# Altium schematic sheet Sensors_IO.SchDoc: Internal Sensors IO
size A4; DrawnBy: Samyar Sadat Akhavi; Revision: 1.0; SheetNumber: 4; SheetTotal: 12
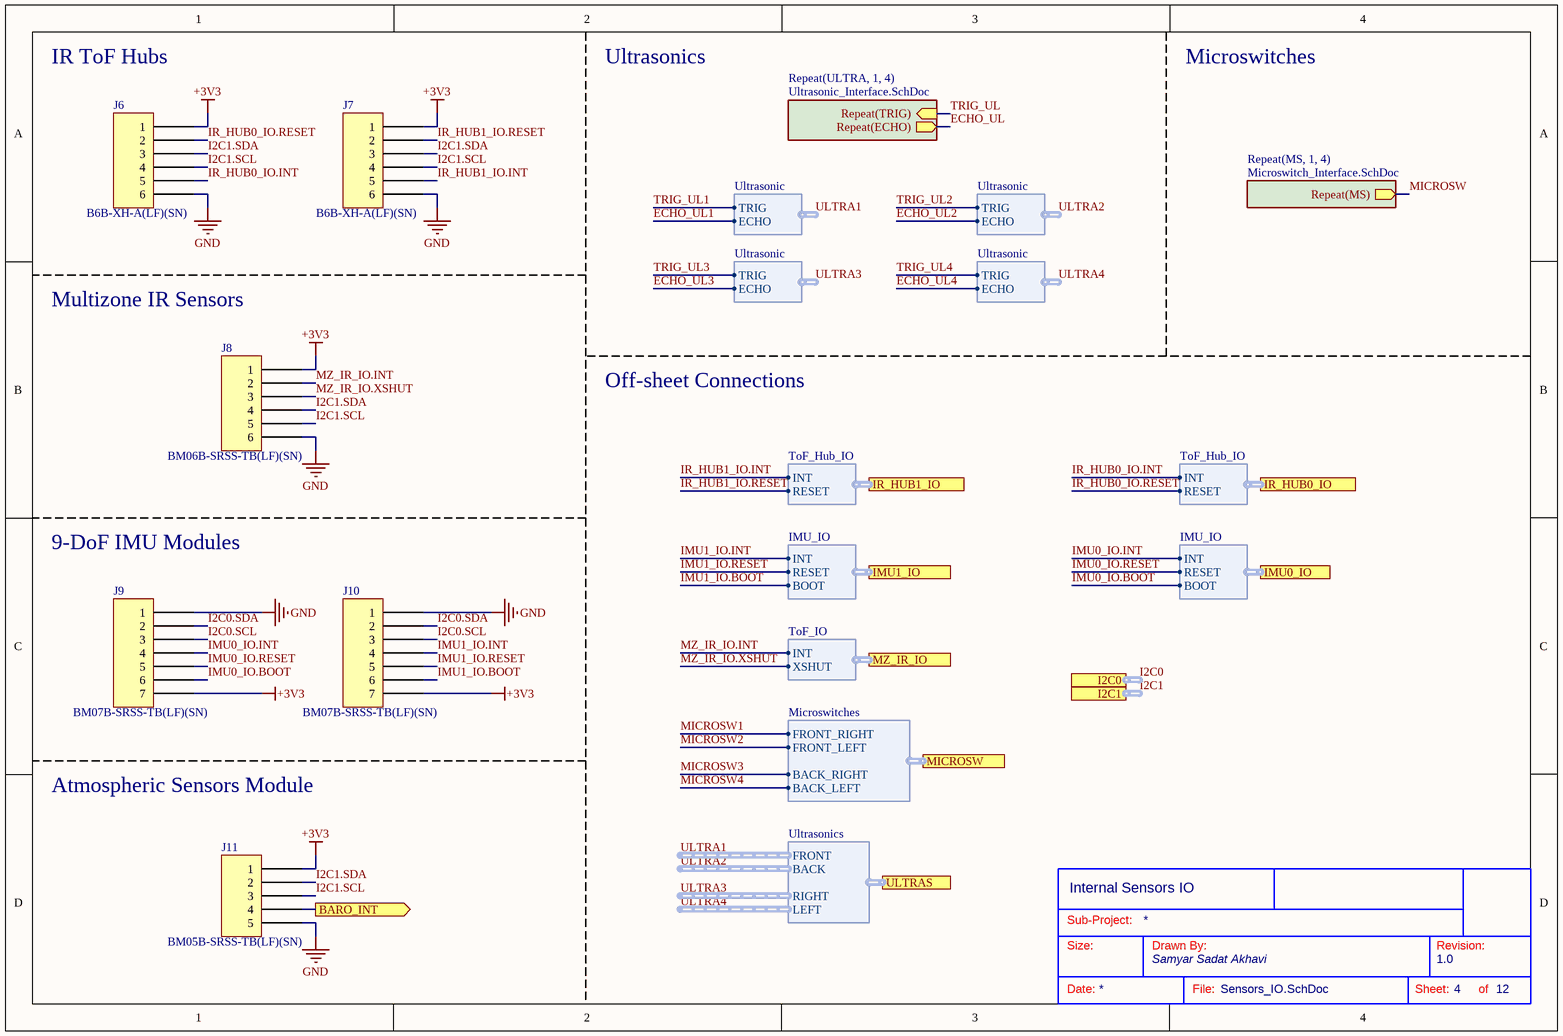
[diagram p0: Sensors_IO.SchDoc]

## Parts
?  (no value)  (graphical)
J6  B6B-XH-A(LF)(SN)  [JST XH B6B-XH-A]
J7  B6B-XH-A(LF)(SN)  [JST XH B6B-XH-A]
J8  BM06B-SRSS-TB(LF)(SN)  [JST BM06B-SRSS-TB]
J9  BM07B-SRSS-TB(LF)(SN)  [JST BM07B-SRSS-TB]
J10  BM07B-SRSS-TB(LF)(SN)  [JST BM07B-SRSS-TB]
J11  BM05B-SRSS-TB(LF)(SN)  [JST BM05B-SRSS-TB]

## Sub-sheets
Repeat(MS, 1, 4) = Microswitch_Interface.SchDoc: Repeat(MS) (out)
Repeat(ULTRA, 1, 4) = Ultrasonic_Interface.SchDoc: Repeat(TRIG) (in), Repeat(ECHO) (out)

## Ports
BARO_INT (out, see Sensors_IO_Board[2B], Microcontroller[3B]), I2C0 (harness I2C, see Sensors_IO_Board[2B], Aux_Power_Bus[4C], Microcontroller[5C], Thermal[4C]), I2C1 (harness I2C, see Sensors_IO_Board[2B], Microcontroller[6C], Thermal[4C]), IMU0_IO (harness IMU_IO, see Sensors_IO_Board[2B], Microcontroller[3B]), IMU1_IO (harness IMU_IO, see Sensors_IO_Board[2B], Microcontroller[3B]), IR_HUB0_IO (harness TOF_HUB_IO, see Sensors_IO_Board[2B], Microcontroller[3B]), IR_HUB1_IO (harness TOF_HUB_IO, see Sensors_IO_Board[2B], Microcontroller[3B]), MICROSW (harness Microswitches, see Sensors_IO_Board[2B], Microcontroller[3B]), MZ_IR_IO (harness TOF_IO, see Sensors_IO_Board[2B], Microcontroller[3B]), ULTRAS (harness Ultrasonics, see Sensors_IO_Board[2B], Microcontroller[3B])

## Harnesses
Microswitches: BACK_LEFT, FRONT_RIGHT, FRONT_LEFT, BACK_RIGHT
IMU_IO: INT, RESET, BOOT
ToF_IO: INT, XSHUT
ToF_Hub_IO: INT, RESET
Ultrasonics: LEFT, FRONT, BACK, RIGHT
Ultrasonic: TRIG, ECHO

## Nets
+3V3: J6.1 J7.1 J8.1 J9.7 J10.7 J11.1
GND: J6.6 J7.6 J8.6 J9.1 J10.1 J11.5
BARO_INT: J11.4 ; port BARO_INT
ECHO_UL: sheet Repeat(ULTRA, 1, 4)/Repeat(ECHO)
ECHO_UL1: harness Ultrasonic.ECHO
ECHO_UL2: harness Ultrasonic.ECHO
ECHO_UL3: harness Ultrasonic.ECHO
ECHO_UL4: harness Ultrasonic.ECHO
I2C0.SCL: J9.3 J10.3
I2C0.SDA: J9.2 J10.2
I2C1.SCL: J6.4 J7.4 J8.5 J11.3
I2C1.SDA: J6.3 J7.3 J8.4 J11.2
IMU0_IO.BOOT: J9.6 ; port IMU0_IO.BOOT
IMU0_IO.INT: J9.4 ; port IMU0_IO.INT
IMU0_IO.RESET: J9.5 ; port IMU0_IO.RESET
IMU1_IO.BOOT: J10.6 ; port IMU1_IO.BOOT
IMU1_IO.INT: J10.4 ; port IMU1_IO.INT
IMU1_IO.RESET: J10.5 ; port IMU1_IO.RESET
IR_HUB0_IO.INT: J6.5 ; port IR_HUB0_IO.INT
IR_HUB0_IO.RESET: J6.2 ; port IR_HUB0_IO.RESET
IR_HUB1_IO.INT: J7.5 ; port IR_HUB1_IO.INT
IR_HUB1_IO.RESET: J7.2 ; port IR_HUB1_IO.RESET
MICROSW: sheet Repeat(MS, 1, 4)/Repeat(MS)
MICROSW1: port MICROSW.FRONT_RIGHT
MICROSW2: port MICROSW.FRONT_LEFT
MICROSW3: port MICROSW.BACK_RIGHT
MICROSW4: port MICROSW.BACK_LEFT
MZ_IR_IO.INT: J8.2 ; port MZ_IR_IO.INT
MZ_IR_IO.XSHUT: J8.3 ; port MZ_IR_IO.XSHUT
TRIG_UL: sheet Repeat(ULTRA, 1, 4)/Repeat(TRIG)
TRIG_UL1: harness Ultrasonic.TRIG
TRIG_UL2: harness Ultrasonic.TRIG
TRIG_UL3: harness Ultrasonic.TRIG
TRIG_UL4: harness Ultrasonic.TRIG

## Buses and harness runs
harness I2C0 = port I2C0
harness I2C1 = port I2C1

## Notes on the sheet
- IR ToF Hubs
- Ultrasonics
- Microswitches
- Multizone IR Sensors
- Off-sheet Connections
- 9-DoF IMU Modules
- Atmospheric Sensors Module
- Sub-Project:
- Size:
- Drawn By:
- Revision:
- Date:
- File:
- Sheet:
- of

## Library data of the parts
? = Standard Title Block
J6 J7 = B6B-XH-A(LF)(SN): CONN HEADER VERT 6POS 2.5MM; Manufacturer: JST Sales America Inc.; Contact Length - Post: 0.134" (3.40mm); Current Rating (Amps): 3A; Material Flammability Rating: UL94 V-0; Number of Positions: 6; Number of Positions Loaded: All; Pitch - Mating: 0.098" (2.50mm); Shrouding: Shrouded - 4 Wall; Style: Board to Cable/Wire; Voltage Rating: 250V; Part Number: B6B-XH-A(LF)(SN); ComponentLink1Description: Datasheet; ComponentLink1URL: http://www.jst-mfg.com/product/pdf/eng/eXH.pdf; ComponentLink2Description: DigiKey Link; ComponentLink2URL: http://digikey.com/product-detail/en/jst-sales-america-inc/B6B-XH-A-LF-SN/455-2271-ND/1000381; Connector Type: Header; Contact Finish - Mating: Tin; Contact Finish - Post: Tin; Contact Material: Brass; Contact Shape: Square; Contact Type: Male Pin; Fastening Type: Detent Lock; Insulation Color: Natural; Insulation Height: 0.276" (7.00mm); Insulation Material: Polyamide (PA66), Nylon 6/6; LastUpdated: 1/12/2020 11:46:58 PM; Lifecycle Status: Active; Minimum Order: 1; Mounting Type: Through Hole; Number of Rows: 1; Operating Temperature: -25°C ~ 85°C; Packaging: Bulk; PartId: 71; Part Status: Active; Price: 0.27; Series: XH; Supplier 1: DigiKey; Supplier Part Number 1: 455-2271-ND; Termination: Press-Fit, Solder
J8 = BM06B-SRSS-TB(LF)(SN): CONN HEADER SMD 6POS 1MM; Manufacturer: JST Sales America Inc.; Current Rating (Amps): 0.7A; Material Flammability Rating: UL94 V-0; Number of Positions: 6; Number of Positions Loaded: All; Pitch - Mating: 0.039" (1.00mm); Shrouding: Shrouded - 4 Wall; Style: Board to Cable/Wire; Voltage Rating: 50V; Part Number: BM06B-SRSS-TB(LF)(SN); ComponentLink1Description: Datasheet; ComponentLink1URL: http://www.jst-mfg.com/product/pdf/eng/eSH.pdf; ComponentLink2Description: DigiKey Link; ComponentLink2URL: http://digikey.com/product-detail/en/jst-sales-america-inc/BM06B-SRSS-TB-LF-SN/455-1792-1-ND/926863; Connector Type: Header; Contact Finish - Mating: Tin; Contact Finish - Post: Tin; Contact Material: Copper Alloy; Contact Shape: Square; Contact Type: Male Pin; Fastening Type: Push-Pull; Features: Solder Retention; Insulation Color: Natural; Insulation Height: 0.167" (4.25mm); Insulation Material: Polyamide (PA), Nylon; LastUpdated: 1/12/2020 10:14:30 PM; Lifecycle Status: Active; Minimum Order: 1; Mounting Type: Surface Mount; Number of Rows: 1; Operating Temperature: -25°C ~ 85°C; Packaging: TapeAndReel; PartId: 20; Part Status: Active; Price: 0.38; Series: SR; Supplier 1: DigiKey; Supplier Part Number 1: 455-1792-1-ND; Termination: Solder
J9 J10 = BM07B-SRSS-TB(LF)(SN): CONN HEADER SMD 7POS 1MM; Manufacturer: JST Sales America Inc.; Current Rating (Amps): 0.7A; Material Flammability Rating: UL94 V-0; Number of Positions: 7; Number of Positions Loaded: All; Pitch - Mating: 0.039" (1.00mm); Shrouding: Shrouded - 4 Wall; Style: Board to Cable/Wire; Voltage Rating: 50V; Part Number: BM07B-SRSS-TB(LF)(SN); ComponentLink1Description: Datasheet; ComponentLink1URL: http://www.jst-mfg.com/product/pdf/eng/eSH.pdf; ComponentLink2Description: DigiKey Link; ComponentLink2URL: http://digikey.com/product-detail/en/jst-sales-america-inc/BM07B-SRSS-TB-LF-SN/455-1793-1-ND/926864; Connector Type: Header; Contact Finish - Mating: Tin; Contact Finish - Post: Tin; Contact Material: Copper Alloy; Contact Shape: Square; Contact Type: Male Pin; Fastening Type: Push-Pull; Features: Solder Retention; Insulation Color: Natural; Insulation Height: 0.167" (4.25mm); Insulation Material: Polyamide (PA), Nylon; LastUpdated: 1/12/2020 10:15:04 PM; Lifecycle Status: Active; Minimum Order: 1; Mounting Type: Surface Mount; Number of Rows: 1; Operating Temperature: -25°C ~ 85°C; Packaging: TapeAndReel; PartId: 22; Part Status: Active; Price: 0.42; Series: SR; Supplier 1: DigiKey; Supplier Part Number 1: 455-1793-1-ND; Termination: Solder
J11 = BM05B-SRSS-TB(LF)(SN): CONN HEADER SMD 5POS 1MM; Manufacturer: JST Sales America Inc.; Current Rating (Amps): 0.7A; Material Flammability Rating: UL94 V-0; Number of Positions: 5; Number of Positions Loaded: All; Pitch - Mating: 0.039" (1.00mm); Shrouding: Shrouded - 4 Wall; Style: Board to Cable/Wire; Voltage Rating: 50V; Part Number: BM05B-SRSS-TB(LF)(SN); ComponentLink1Description: Datasheet; ComponentLink1URL: http://www.jst-mfg.com/product/pdf/eng/eSR.pdf; ComponentLink2Description: DigiKey Link; ComponentLink2URL: http://digikey.com/product-detail/en/jst-sales-america-inc/BM05B-SRSS-TB-LF-SN/455-1791-1-ND/926862; Connector Type: Header; Contact Finish - Mating: Tin; Contact Finish - Post: Tin; Contact Material: Copper Alloy; Contact Shape: Square; Contact Type: Male Pin; Fastening Type: Push-Pull; Features: Solder Retention; Insulation Color: Natural; Insulation Height: 0.167" (4.25mm); Insulation Material: Polyamide (PA), Nylon; LastUpdated: 1/12/2020 10:14:00 PM; Lifecycle Status: Active; Minimum Order: 1; Mounting Type: Surface Mount; Number of Rows: 1; Operating Temperature: -25°C ~ 85°C; Packaging: TapeAndReel; PartId: 18; Part Status: Active; Price: 0.35; Series: SR; Supplier 1: DigiKey; Supplier Part Number 1: 455-1791-1-ND; Termination: Solder